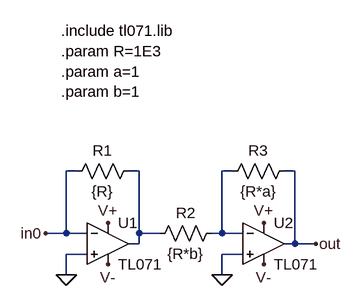
[diagram p0: schematic summer_sj.asc]
summer_sj.asc, the LTspice schematic file:
Version 4
SHEET 1 880 956
WIRE 176 416 160 416
WIRE 272 416 256 416
WIRE 416 416 400 416
WIRE 512 416 496 416
WIRE 160 512 160 416
WIRE 160 512 128 512
WIRE 192 512 160 512
WIRE 272 512 272 416
WIRE 304 512 272 512
WIRE 400 512 400 416
WIRE 400 512 384 512
WIRE 432 512 400 512
WIRE 272 528 272 512
WIRE 272 528 256 528
WIRE 512 528 512 416
WIRE 512 528 496 528
WIRE 544 528 512 528
WIRE 192 544 160 544
WIRE 432 544 400 544
WIRE 160 576 160 544
WIRE 400 576 400 544
FLAG 128 512 in0
FLAG 544 528 out
FLAG 160 576 0
FLAG 400 576 0
FLAG 224 496 V+
FLAG 224 560 V-
FLAG 464 496 V+
FLAG 464 560 V-
SYMBOL res 272 400 R90
WINDOW 0 0 56 VBottom 2
WINDOW 3 32 56 VTop 2
SYMATTR InstName R1
SYMATTR Value {R}
SYMBOL res 400 496 R90
WINDOW 0 0 56 VBottom 2
WINDOW 3 32 56 VTop 2
SYMATTR InstName R2
SYMATTR Value {R*b}
SYMBOL res 512 400 R90
WINDOW 0 0 56 VBottom 2
WINDOW 3 32 56 VTop 2
SYMATTR InstName R3
SYMATTR Value {R*a}
SYMBOL opamp2 224 464 R0
SYMATTR InstName U1
SYMATTR Value TL071
SYMBOL opamp2 464 464 R0
SYMATTR InstName U2
SYMATTR Value TL071
TEXT 152 200 Left 2 !.include tl071.lib\n.param R=1E3\n.param a=1\n.param b=1

The netlist it stands for:
* summer_sj.asc
R1 N001 in0 {R}
R2 N002 N001 {R*b}
R3 out N002 {R*a}
XU1 0 in0 V+ V- N001 TL071  ; pins In+ In- V+ V- OUT
XU2 0 N002 V+ V- out TL071  ; pins In+ In- V+ V- OUT
.include tl071.lib
.param R=1E3
.param a=1
.param b=1
.backanno
.end